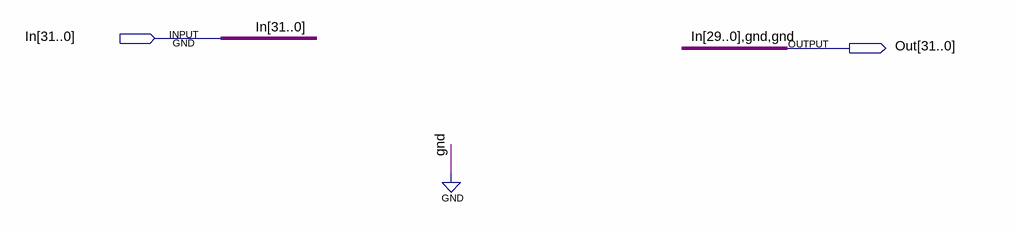
[diagram p0: schematic sheet]
// Quartus schematic Shift_2bits.bdf as structural Verilog: 0 symbols, 2 pins
module Shift_2bits (
  input  [31:0] In,
  output [31:0] Out
);


  assign Out = {In[29:0], 2'b00};
endmodule
